# Altium schematic sheet Resolver.SchDoc
size A4; CompanyName: Technische Hochschule Nürnberg Georg Simon Ohm; DrawnBy: Bauer Martin; Engineer: Bauer Martin; Organization: UltraZohm; Address1: Kesslerplatz 12; Address2: 90489 Nürnberg; Address3: GERMANY; DocumentNumber: 3; SheetNumber: 3; SheetTotal: 6; Website: www.ultrazohm.com
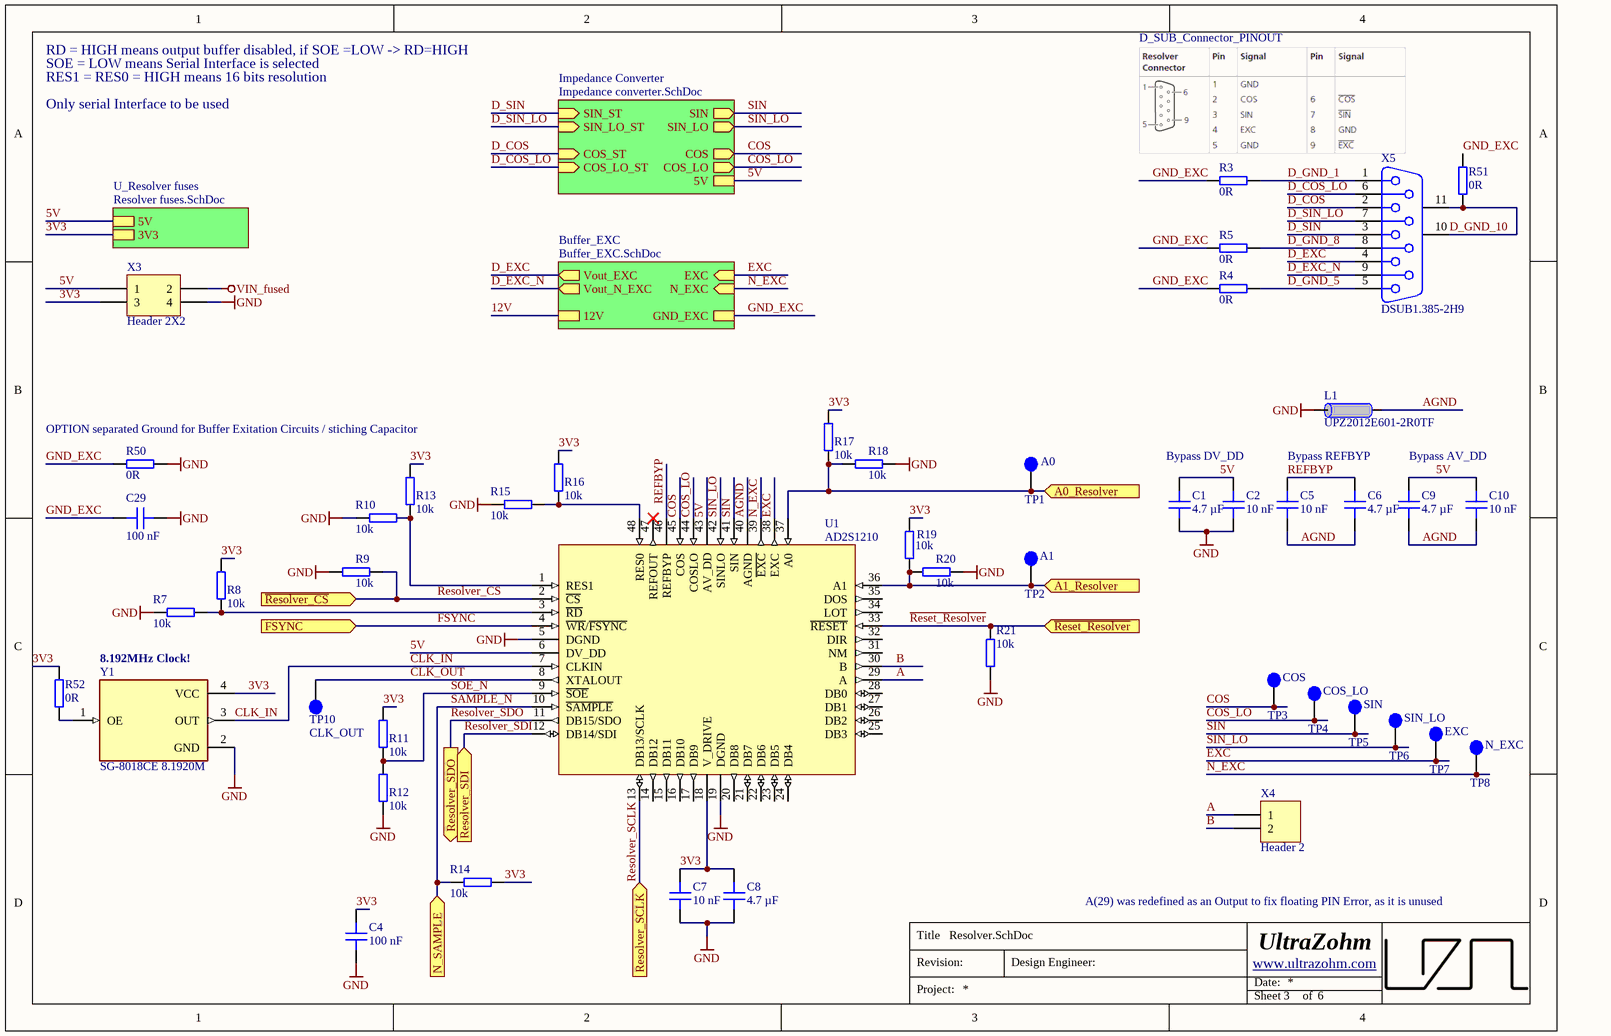
[diagram p0: Resolver.SchDoc]

## Parts
C1  4.7 µF  [C_0603]
C2  10 nF  [C_0603]
C4  100 nF  [C_0603]
C5  10 nF  [C_0603]
C6  4.7 µF  [C_0603]
C7  10 nF  [C_0603]
C8  4.7 µF  [C_0603]
C9  4.7 µF  [C_0603]
C10  10 nF  [C_0603]
C29  100 nF  [C_0603]
L1  UPZ2012E601-2R0TF  [INDC2012X92N_V]
R3  0R  [RES 0603_1608]
R4  0R  [RES 0603_1608]
R5  0R  [RES 0603_1608]
R7  10k  [RES 0603_1608]
R8  10k  [RES 0603_1608]
R9  10k  [RES 0603_1608]
R10  10k  [RES 0603_1608]
R11  10k  [RES 0603_1608]
R12  10k  [RES 0603_1608]
R13  10k  [RES 0603_1608]
R14  10k  [RES 0603_1608]
R15  10k  [RES 0603_1608]
R16  10k  [RES 0603_1608]
R17  10k  [RES 0603_1608]
R18  10k  [RES 0603_1608]
R19  10k  [RES 0603_1608]
R20  10k  [RES 0603_1608]
R21  10k  [RES 0603_1608]
R50  0R  [RES 0603_1608]
R51  0R  [RES 0603_1608]
R52  0R  [RES 0603_1608]
TP1  A0  [TP_1mm]  (no BOM)
TP2  A1  [TP_1mm]  (no BOM)
TP3  COS  [TP_1mm]  (no BOM)
TP4  COS_LO  [TP_1mm]  (no BOM)
TP5  SIN  [TP_1mm]  (no BOM)
TP6  SIN_LO  [TP_1mm]  (no BOM)
TP7  EXC  [TP_1mm]  (no BOM)
TP8  N_EXC  [TP_1mm]  (no BOM)
TP10  CLK_OUT  [TP_1mm]  (no BOM)
U1  AD2S1210  [LQFP-48_L]
X3  Header 2X2  [HDR2X2]
X4  Header 2  [HDR1X2]
X5  DSUB1.385-2H9  [DSUB1.385-2H9]
Y1  SG-8018CE 8.1920M  [OSCCC320X250X120N]

## Sub-sheets
Buffer_EXC = Buffer_EXC.SchDoc: Vout_EXC (out), Vout_N_EXC (out), N_EXC (in), EXC (in), GND_EXC, 12V
Impedance Converter = Impedance converter.SchDoc: SIN_LO (out), COS_LO_ST (in), SIN_ST (in), SIN_LO_ST (in), COS_ST (in), SIN (out), COS_LO (out), COS (out), 5V
U_Resolver fuses = Resolver fuses.SchDoc: 5V, 3V3

## Ports
A0_Resolver (in), A1_Resolver (in), FSYNC (in), N_SAMPLE (in), Resolver_SCLK (in), Resolver_SDI (in), Resolver_SDO (out), ~{Reset_Resolver} (in), ~{Resolver_CS} (in)

## Nets
GND: C1.1 C2.1 C4.1 C7.1 C8.1 C29.2 L1.2 R7.1 R9.2 R10.1 R12.1 R15.1 R18.1 R20.1 R21.2 R50.2 U1.5(DGND) U1.19(DGND) X3.4 Y1.2(GND)
VIN_fused: X3.2
3V3: C4.2 C7.2 C8.2 R8.2 R11.2 R13.2 R14.2 R16.2 R17.2 R19.2 R52.2 U1.18(V_DRIVE) X3.3 Y1.4(VCC) ; sheet U_Resolver fuses/3V3
5V: C1.2 C2.2 C9.1 C10.1 U1.6(DV_DD) U1.43(AV_DD) X3.1 ; sheet Impedance Converter/5V, sheet U_Resolver fuses/5V
12V: sheet Buffer_EXC/12V
~{Reset_Resolver}: R21.1 U1.33(~{RESET}) ; port ~{Reset_Resolver}
~{Resolver_CS}: R9.1 U1.2(~{CS}) ; port ~{Resolver_CS}
A: U1.29(A) X4.1
A0_Resolver: R17.1 R18.2 TP1.1 U1.37(A0) ; port A0_Resolver
A1_Resolver: R19.1 R20.2 TP2.1 U1.36(A1) ; port A1_Resolver
AGND: C5.2 C6.1 C9.2 C10.2 L1.1 U1.40(AGND)
B: U1.30(B) X4.2
CLK_IN: U1.7(CLKIN) Y1.3(OUT)
CLK_OUT: TP10.1 U1.8(XTALOUT)
COS: TP3.1 U1.45(COS) ; sheet Impedance Converter/COS
COS_LO: TP4.1 U1.44(COSLO) ; sheet Impedance Converter/COS_LO
D_COS: X5.2 ; sheet Impedance Converter/COS_ST
D_COS_LO: X5.6 ; sheet Impedance Converter/COS_LO_ST
D_EXC: X5.4 ; sheet Buffer_EXC/Vout_EXC
D_EXC_N: X5.9 ; sheet Buffer_EXC/Vout_N_EXC
D_GND_1: R3.1 X5.1
D_GND_5: R4.1 X5.5
D_GND_8: R5.1 X5.8
D_GND_10: R51.2 X5.10(MH1) X5.11(MH2)
D_SIN: X5.3 ; sheet Impedance Converter/SIN_ST
D_SIN_LO: X5.7 ; sheet Impedance Converter/SIN_LO_ST
EXC: TP7.1 U1.38(EXC) ; sheet Buffer_EXC/EXC
FSYNC: U1.4(~{WR}/~{FSYNC}) ; port FSYNC
GND_EXC: C29.1 R3.2 R4.2 R5.2 R50.1 R51.1 ; sheet Buffer_EXC/GND_EXC
N_EXC: TP8.1 U1.39(~{EXC}) ; sheet Buffer_EXC/N_EXC
REFBYP: C5.1 C6.2 U1.46(REFBYP)
Resolver_SCLK: U1.13(DB13/SCLK) ; port Resolver_SCLK
Resolver_SDI: U1.12(DB14/SDI) ; port Resolver_SDI
Resolver_SDO: U1.11(DB15/SDO) ; port Resolver_SDO
SAMPLE_N: R14.1 U1.10(~{SAMPLE}) ; port N_SAMPLE
SIN: TP5.1 U1.41(SIN) ; sheet Impedance Converter/SIN
SIN_LO: TP6.1 U1.42(SINLO) ; sheet Impedance Converter/SIN_LO
SOE_N: R11.1 R12.2 U1.9(~{SOE})
NetR7_2: R7.2 R8.1 U1.3(~{RD})
NetR10_2: R10.2 R13.1 U1.1(RES1)
NetR15_2: R15.2 R16.1 U1.48(RES0)
NetR52_1: R52.1 Y1.1(OE)

Not connected (* = marked no-connect by the designer): U1 14(DB12) 15(DB11) 16(DB10) 17(DB9) 20(DB8) 21(DB7) 22(DB6) 23(DB5) 24(DB4) 25(DB3) 26(DB2) 27(DB1) 28(DB0) 31(NM) 32(DIR) 34(LOT) 35(DOS) 47(REFOUT)*

## Notes on the sheet
- D_SUB_Connector_PINOUT
- RD = HIGH means output buffer disabled, if SOE =LOW -> RD=HIGH
- RES1 = RES0 = HIGH means 16 bits resolution
- SOE = LOW means Serial Interface is selected
- Only serial Interface to be used
- OPTION separated Ground for Buffer Exitation Circuits / stiching Capacitor
- Bypass DV_DD
- Bypass REFBYP
- Bypass AV_DD
- 8.192MHz Clock!
- A(29) was redefined as an Output to fix floating PIN Error, as it is unused
- Title
- Revision:
- Design Engineer:
- Date:
- Project:
- Sheet
- of

## Library data of the parts
C1 C6 C8 C9 = GRM188R6YA475KE15D: Capacitor 0603, 35 VDC, 4.7 µF, X5R; Manufacturer: muRata; Tolerance: 10 %; Voltage Rating: 16 VDC; Created from: MGremer; Value: 4.7 µF; Supplier 1: Mouser; Supplier Part Number 1: 81-GRM188R6YA475KE5D; Manufacturer Part Number: GRM188R6YA475KE15D; PartID: 11; Created On: 20.12.2020 13:54:13; ComponentLink1Description: Datasheet; ComponentLink1URL: https://www.mouser.de/datasheet/2/281/murata_03052018_GRM_Series_1-1310166.pdf; Component Type: Capacitor 0603; Device Package: 0603; Last Updated: 20.12.2020 16:34:30; Mounting Type: SMD; Operating Temperature: -55 - 85°C; Series: GRM; Type: Capacitor; Live Cycle Status: 1; Stock number: Labor SMD Container; LCSC Part Number: C19666
C2 C5 C7 C10 = 0603B103K500NT: 50V 10nF X7R ±10% 0603  Multilayer Ceramic Capacitors MLCC - SMD/SMT ROHS; Manufacturer: FH (Guangdong Fenghua Advanced Tech); Voltage Rating: 50 VDC; Created from: AGeiger; Value: 10 nF; Supplier 1: LCSC; Supplier Part Number 1: C57112; Manufacturer Part Number: 0603B103K500NT; PartID: 108; Created On: 21.09.2022 07:22:21; ComponentLink1Description: Datasheet; ComponentLink1URL: https://datasheet.lcsc.com/lcsc/2102081402_FH--Guangdong-Fenghua-Advanced-Tech-0603B103K500NT_C57112.pdf; Component Type: Capacitor 0603; Device Package: 0603; Last Updated: 21.09.2022 07:22:21; Mounting Type: SMD; Operating Temperature: -55 - 125°C; Series: X7R; Type: Capacitor; Tolerance: 10 %; Live Cycle Status: 1; LCSC Part Number: C57112
C4 C29 = CC0603KRX7R9BB104: Capacitor 0603, 50 VDC, 100 nF, X7R; Manufacturer: YAGEO; Tolerance: 10 %; Voltage Rating: 50 VDC; Created from: AGeiger; Manufacturer Part Number: CC0603KRX7R9BB104; PartID: 102; Created On: 22.08.2022 14:35:53; ComponentLink1Description: Datasheet; ComponentLink1URL: https://datasheet.lcsc.com/lcsc/1809301912_YAGEO-CC0603KRX7R9BB104_C14663.pdf; Component Type: Capacitor 0603; Device Package: 0603; Last Updated: 22.08.2022 14:35:53; Mounting Type: SMD; Operating Temperature: -55 - 125°C; Series: X7R; Supplier 1: LCSC; Supplier Part Number 1: C14663; Supplier 2: Mouser; Supplier Part Number 2: 603-CC603KRX7R9BB104; Type: Capacitor; Value: 100 nF; Live Cycle Status: 1; LCSC Part Number: C14663
L1 = UPZ2012E601-2R0TF: 2A 1 90mΩ 600Ω@100MHz ±25% 0805  Ferrite Beads ROHS; Manufacturer: Sunlord; Value: 90 Ohm; Created from: AGeiger; Manufacturer Part Number: UPZ2012E601-2R0TF; PartID: 11; Created On: 03.09.2022 16:57:01; ComponentLink1Description: Datasheet; ComponentLink1URL: https://datasheet.lcsc.com/lcsc/2110091730_Sunlord-UPZ2012E601-2R0TF_C98308.pdf; Component Type: Ferrite Beads; Device Package: 0805; Last Updated: 03.09.2022 17:01:04; Mounting Type: SMD; Operating Temperature: -55 - 125 °C; Supplier 1: LCSC; Supplier Part Number 1: C98308; Type: Ferrite Bead; DC current: 2 A; Live Cycle Status: 1; LCSC Part Number: C98308
R3-R5 R50-R52 = RC0603JR-070RL: SMD resistor E24 series; Manufacturer: YAGEO; Tolerance: 5%; Created from: MGremer; Manufacturer Part Number: RC0603JR-070RL; PartID: 1; Created On: 14.12.2020 16:17:14; ComponentLink1Description: Datasheet; ComponentLink1URL: https://www.mouser.de/datasheet/2/447/PYu-RC_Group_51_RoHS_L_10-1664068.pdf; Component Type: SMD resistor; Device Package: 0603; Last Updated: 04.03.2021 09:09:42; Mounting Type: SMD; Supplier 1: Mouser; Supplier Part Number 1: 603-RC0603JR-070RL; Supplier 2: LCSC; Supplier Part Number 2: C21189; Type: Resistor; Value: 0R; Live Cycle Status: 1; Stock number: Labor SMD Container; LCSC Part Number: C21189
R7-R21 = RK73B1JTTD103J: SMD resistor E24 series; Manufacturer: KOA Speer; Tolerance: 5%; Created from: MGremer; Value: 10k; Supplier 1: Mouser; Supplier Part Number 1: 660-RK73B1JTTD103J; Manufacturer Part Number: RK73B1JTTD103J; PartID: 98; Created On: 14.12.2020 16:17:14; ComponentLink1Description: Datasheet; ComponentLink1URL: https://www.mouser.de/datasheet/2/219/RK73B-1825463.pdf; Component Type: SMD resistor; Device Package: 0603; Last Updated: 27.05.2022 14:04:22; Mounting Type: SMD; Type: Resistor; Live Cycle Status: 1; Stock number: Labor SMD Container; LCSC Part Number: C25804
TP1-TP8 TP10 = TP_1mm: Testpoint 1mm; Created: 2018_06_25_AGeiger; Value: Testpoint 1mm
U1 = AD2S1210: Variable Resolution, 10-Bit to 16-Bit R/D Converter with Reference Oscillator; MPN: AD2S1210WDSTZRL7; MF: Analog Devices; Package: LQFP-48; Value: AD2S1210; Created: 2019_04_20_AGeiger; ComponentLink1Description: Datasheet; ComponentLink1URL: https://www.analog.com/media/en/technical-documentation/data-sheets/AD2S1210.pdf; Supplier 1: Mouser; Supplier Part Number 1: 584-AD2S1210WDSTZR7; Supplier Part Number 2: AD2S1210WDSTZRL7CT-ND; Supplier 2: Digi-Key; LCSC Part Number: C408404
X3 = Header 2X2: Header, 2-Pin, Dual row; LatestRevisionDate: 17-Jul-2002; LatestRevisionNote: Re-released for DXP Platform.; Publisher: Altium Limited
X4 = Header 2: Header, 2-Pin; LatestRevisionDate: 17-Jul-2002; LatestRevisionNote: Re-released for DXP Platform.; Publisher: Altium Limited
X5 = DSUB1.385-2H9: Connector; D Subminiature; 9 Position; Right Angle; Pitch 1.385 mm; Manufacturer: TE Connectivity; PackageDocument: O; Positions: 9; Gender: Receptacle; Created from: MHlatky; Published: 15-Jun-2001; LatestRevisionDate: 17-Jul-2002; LatestRevisionNote: Re-released for DXP Platform.; DatasheetDocument: 1-Sep-1999; PackageReference: 788750; Publisher: Altium Limited; Orientation: Right Angle; Manufacturer Part Number: DSUB1.385-2H9; PartID: 5; Created On: 26.01.2021 09:19:51; ComponentLink1Description: Datasheet; ComponentLink1URL: https://www.mouser.de/datasheet/2/418/7/ENG_CD_2311765_D-2072985.pdf; Component Type: DSUB Connector; Device Package: -; Last Updated: 27.05.2022 15:54:50; Supplier 1: Mouser; Supplier Part Number 1: 571-2311765-1; Type: DSUB Connector; Live Cycle Status: 1; LCSC Part Number: C141882; Stock number: not stored
Y1 = SG-8018CE_8.1920M-TJHPA0: 8.192 MHz XO (Standard) CMOS Oscillator 1.62V ~ 3.63V Enable/Disable 4-SMD, No Lead; MPN: SG-8018CE 8.1920M-TJHPA0; MF: EPSON; LCSC Part Number: C390481; Value: SG-8018CE 8.1920M